# Altium schematic sheet usbtinyisp.SchDoc: USBtinyISP with Buffer
size A4; Author: Meysam Parvizi; DrawnBy: Meysam Parvizi; Engineer: Meysam Parvizi
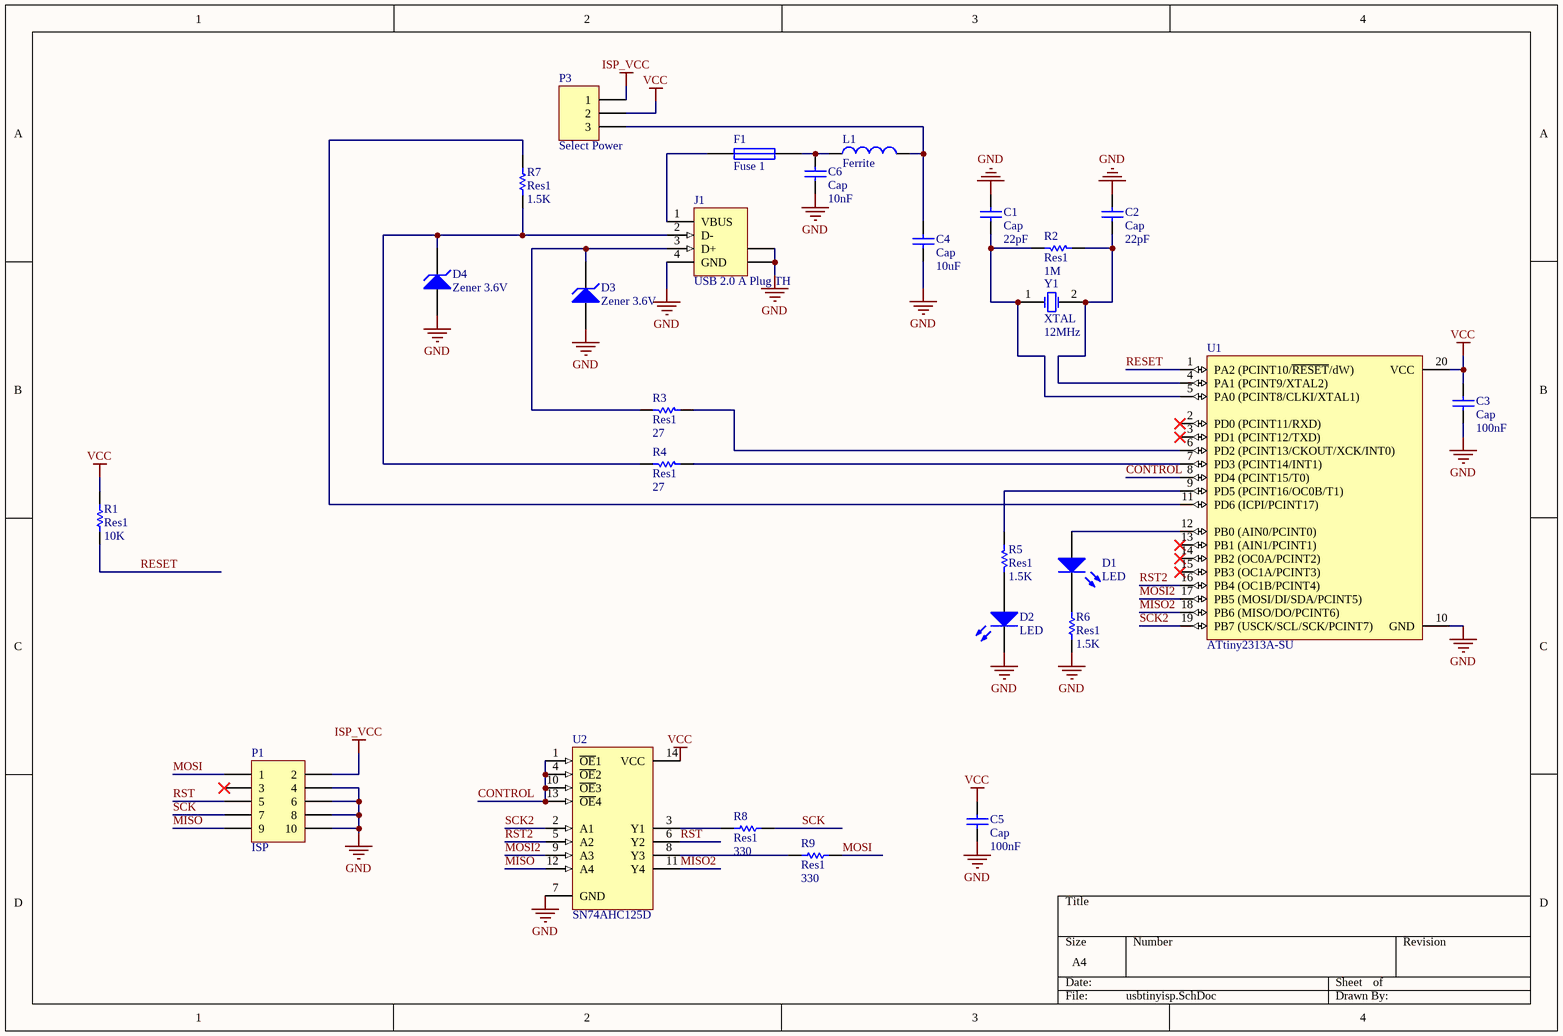
[diagram p0: usbtinyisp.SchDoc]

## Parts
C1  Cap  value 22pF  [C0805]
C2  Cap  value 22pF  [C0805]
C3  Cap  value 100nF  [C0805]
C4  Cap  value 10uF  [C0805]
C5  Cap  value 100nF  [C0805]
C6  Cap  value 10nF  [C0805]
D1  LED  [C0805]
D2  LED  [C0805]
D3  Zener 3.6V  [DO-35]
D4  Zener 3.6V  [DO-35]
F1  Fuse 1  [C0805]
J1  USB 2.0 A Plug TH  [USB2_A_TH_PLUG]
L1  Ferrite  [C0805]
P1  ISP  [BOX2X5_PCB_EDGE]
P3  Select Power  [HDR1X3]
R1  Res1  value 10K  [C0805]
R2  Res1  value 1M  [C0805]
R3  Res1  value 27  [C0805]
R4  Res1  value 27  [C0805]
R5  Res1  value 1.5K  [C0805]
R6  Res1  value 1.5K  [C0805]
R7  Res1  value 1.5K  [C0805]
R8  Res1  value 330  [C0805]
R9  Res1  value 330  [C0805]
U1  ATtiny2313A-SU  [20S_M]
U2  SN74AHC125D  [D014_M]
Y1  XTAL  value 12MHz  [XTAL]

## Nets
GND: C1.1 C2.1 C3.1 C4.2 C5.1 C6.1 D2.2(K) D3.1(A) D4.1(A) J1.4(GND) J1.5(SHLD) J1.6(SHLD) P1.4 P1.6 P1.8 P1.10 R6.2 U1.10(GND) U2.7(GND)
ISP_VCC: P1.2 P3.1
VCC: C3.2 C5.2 P3.2 R1.2 U1.20(VCC) U2.14(VCC)
CONTROL: U1.8(PD4_(PCINT15/T0)) U2.1(~{OE}1) U2.4(~{OE}2) U2.10(~{OE}3) U2.13(~{OE}4)
MISO: P1.9 U2.12(A4)
MISO2: U1.18(PB6_(MISO/DO/PCINT6)) U2.11(Y4)
MOSI: P1.1 R9.2
MOSI2: U1.17(PB5_(MOSI/DI/SDA/PCINT5)) U2.9(A3)
RESET: R1.1 U1.1(PA2_(PCINT10/~{RESET}/dW))
RST: P1.5 U2.6(Y2)
RST2: U1.16(PB4_(OC1B/PCINT4)) U2.5(A2)
SCK: P1.7 R8.2
SCK2: U1.19(PB7_(USCK/SCL/SCK/PCINT7)) U2.2(A1)
NetC1_2: C1.2 R2.2 U1.5(PA0_(PCINT8/CLKI/XTAL1)) Y1.1(OSC1)
NetC2_2: C2.2 R2.1 U1.4(PA1_(PCINT9/XTAL2)) Y1.2(OSC2)
NetC4_1: C4.1 L1.1 P3.3
NetC6_2: C6.2 F1.1 L1.2
NetD1_1: D1.1(A) U1.12(PB0_(AIN0/PCINT0))
NetD1_2: D1.2(K) R6.1
NetD2_1: D2.1(A) R5.2
NetD3_2: D3.2(K) J1.3(D+) R3.1
NetD4_2: D4.2(K) J1.2(D-) R4.1 R7.1
NetF1_2: F1.2 J1.1(VBUS)
NetR3_2: R3.2 U1.6(PD2_(PCINT13/CKOUT/XCK/INT0))
NetR4_2: R4.2 U1.7(PD3_(PCINT14/INT1))
NetR5_1: R5.1 U1.9(PD5_(PCINT16/OC0B/T1))
NetR7_2: R7.2 U1.11(PD6_(ICPI/PCINT17))
NetR8_1: R8.1 U2.3(Y1)
NetR9_1: R9.1 U2.8(Y3)

Not connected (* = marked no-connect by the designer): P1 3*; U1 2(PD0_(PCINT11/RXD))* 3(PD1_(PCINT12/TXD))* 13(PB1_(AIN1/PCINT1))* 14(PB2_(OC0A/PCINT2))* 15(PB3_(OC1A/PCINT3))*

## Library data of the parts
C1-C6 = Cap: Capacitor; Published: 8-Jun-2000; LatestRevisionDate: 17-Jul-2002; LatestRevisionNote: Re-released for DXP Platform.; PackageReference: RAD-0.3; Publisher: Altium Limited; PackageDescription: Radial Cap, Thru-Hole; 2 Leads; 0.3 in Pin Spacing
D1 D2 = LED: Typical RED GaAs LED; Designer: Meysam Parvizi; Email: meysam.parvizi.ir@gmail.com; Weblog: http://mp.tabin.ir
D3 D4 = D Zener: Zener Diode; Published: 8-Jun-2000; LatestRevisionDate: 17-Jul-2002; LatestRevisionNote: Re-released for DXP Platform.; PackageReference: DIODE-0.7; Publisher: Altium Limited; PackageDescription: Diode, Thru-Hole; 2 Leads; 0.7 in Pin Spacing
F1 = Fuse 1: Fuse; Published: 8-Jun-2000; LatestRevisionDate: 17-Jul-2002; LatestRevisionNote: Re-released for DXP Platform.; PackageReference: PIN-W2/E2.8; Publisher: Altium Limited; PackageDescription: Thru-Hole; 2 Leads
J1 = USB 2.0 A Plug TH: USB 2.0 A Plug, Thru-Hole
L1 = Inductor: Code_IEC: 1005; Value: 10uH; Published: 8-Jun-2000; LatestRevisionDate: 29-May-2009; LatestRevisionNote: IPC-7351 Footprint Added.; PackageReference: 0402-A; Publisher: Altium Limited; PackageDescription: Chip Inductor; Code_JEITA: 0402
P1 = Box 5X2: Box, 5-Pin, Dual row; Designer: Meysam Parvizi; Email: meysam.parvizi.ir@gmail.com; Weblog: http://mp.tabin.ir
P3 = Header 3: Header, 3-Pin; LatestRevisionDate: 17-Jul-2002; LatestRevisionNote: Re-released for DXP Platform.; Publisher: Altium Limited
R1-R9 = Res1: Resistor; Published: 8-Jun-2000; LatestRevisionDate: 17-Jul-2002; LatestRevisionNote: Re-released for DXP Platform.; PackageReference: AXIAL-0.3; Publisher: Altium Limited; PackageDescription: Axial Device, Thru-Hole; 2 Leads; 0.3 in Pin Spacing
U1 = ATtiny2313A-SU: 8-bit AVR Microcontroller, 1.8-5.5V, 2KB Flash, 128 Bytes EEPROM, 128 Bytes SRAM, 20-pin SOIC, Industrial Grade (-40°C to 85°C), Pb-Free; Published: 1-Apr-2010; DatasheetVersion: revA, Dec-2009; PackageVersion: revA, Jan-2002; PackageReference: 20S; Publisher: Altium Limited; PackageDescription: 20-lead, 0.300" Wide Body, Plastic Gull Wing Small Outline Package (SOIC); Supplier 1: Digi-Key; Supplier Part Number 1: ATTINY2313A-SU-ND; Supplier 2: Mouser; Supplier Part Number 2: 556-ATTINY2313A-SU; Code_JEDEC: MS-013-AC; Code_IPC: SOIC127P1030-20; ComponentLink1Description: Manufacturer Link; ComponentLink1URL: http://www.atmel.com/products/avr/default.asp?; ComponentLink2Description: ATtiny2313A/4313 Datasheet; ComponentLink2URL: http://www.atmel.com/dyn/resources/prod_documents/doc8246.pdf; ComponentLink3Description: ATtiny2313A/4313 Summary; ComponentLink3URL: http://www.atmel.com/dyn/resources/prod_documents/8246S.pdf; ComponentLink4Description: Atmel.com Home; ComponentLink4URL: http://www.atmel.com
U2 = SN74AHC125D: Quadruple Bus Buffer Gate with 3-State Outputs; Published: 8-Jun-2000; LatestRevisionDate: 13-Apr-2006; LatestRevisionNote: IPC-7351 Footprint Added.; DatasheetVersion: Jul-1998; PackageVersion: Jan-1998; PackageReference: D014; Publisher: Altium Limited; PackageDescription: 14-Pin Small Outline Integrated Circuit 1.27 mm Pitch; Code_IPC: SOIC127P600-14; ComponentLink1Description: Manufacturer Link; ComponentLink1URL: http://www.ti.com/; ComponentLink2Description: Datasheet; ComponentLink2URL: http://www-s.ti.com/sc/ds/sn74ahc125.pdf
Y1 = XTAL: Crystal Oscillator; Designer: Meysam Parvizi; Email: meysam.parvizi.ir@gmail.com; Weblog: http://mp.tabin.ir